# Altium schematic sheet IR_LED.SchDoc
size 420 x 297 mm; Revision: V1.2.1; SheetNumber: 9; SheetTotal: 11
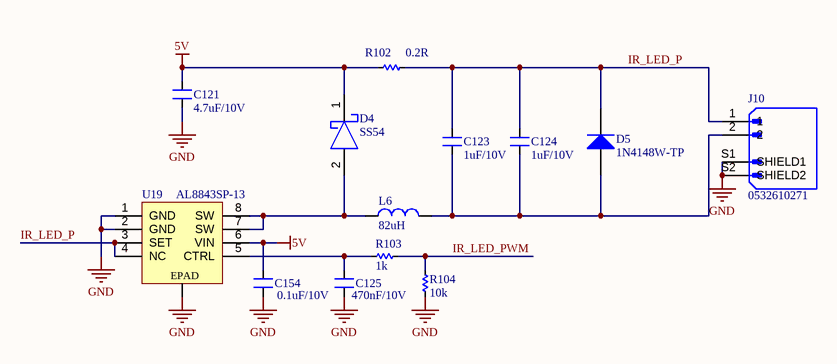
[diagram p0: IR_LED.SchDoc]

## Parts
C121  4.7uF/10V  [CAP_C_1608X80]
C123  1uF/10V  [CAP_C_1608X80]
C124  1uF/10V  [CAP_C_1608X80]
C125  470nF/10V  [CAP_C_1608X80]
C154  0.1uF/10V  [CAP_C_1608X80]
D4  SS54  [DO214-AC-SMA]
D5  1N4148W-TP  [SOD-123]
J10  0532610271  [0532610271]
L6  82uH  [L-SMD-M-4.8x4.8x2.8mm]
R102  0.2R  [RES_C_3216X70]
R103  1k  [RES_C_1608X60]
R104  10k  [RES_C_1608X60]
U19  AL8843SP-13  [SO8_EPAD]

## Nets
5V: C121.2 C154.2 D4.1 R102.2 U19.6(VIN)
GND: C121.1 C125.1 C154.1 J10.S1(SHIELD1) J10.S2(SHIELD2) R104.1 U19.1(GND) U19.2(GND) U19.EPAD
IR_LED_P: C123.2 C124.2 D5.2(K) J10.1 R102.1 U19.3(SET) U19.4(NC)
IR_LED_PWM: R103.2 R104.2
NetC123_1: C123.1 C124.1 D5.1(A) J10.2 L6.2
NetC125_2: C125.2 R103.1 U19.5(CTRL)
NetD4_2: D4.2 L6.1 U19.7(SW) U19.8(SW)

## Notes on the sheet
- Project:
- BEE-PC1
- Sub-system:
- NANORACK_EXP_CONTROLLER
- Design by:
- SANG HUYNH
- BAO BUI Q.
- Sheet title:
- Sheet
- A3
- of
- Checked by:
- Approved by:
- VU PHAM
- Revision:
- Document No:
- Size:
- Date:

## Library data of the parts
C121 C123-C125 C154 = Capacitors: Value: 33pF
D4 = SS54: DIODE SCHOTTKY 60V 3A DO214AA
D5 = 1N4148-W-7: DIODE GEN PURP 100V 300MA SOD123; MPN: 1N4148W-7-F; MFR: Diodes Incorporated; Solder: SMT; Value: 100V/300MA
J10 = CONN_SMD_02: CONN HEADER SMD R/A 2POS 1.25MM
L6 = L-SMD-1: SRR4828A-820M; partNo: 78477010; Manufacturer: Wurth Elektronik; Inductance: 1.0 μH; ComponentLink1Description: Manufacturer; ComponentLink1URL: http://www.we-online.de; Created by: Baojun Chen; Created Date: Nov.2015; ComponentLink2Description: Datasheet; ComponentLink2URL: http://katalog.we-online.de/pbs/datasheet/78477010.pdf
R102 = Res-SMD: RES 0.2 OHM 1% 1W 1206; Manufacturer: Generic Components; Class: Passive; Published: 08/06/2000; Publisher: Altium Hobart Technology Centre
R103 R104 = Res SMD: SMD; Manufacturer: Generic Components; Class: Passive; Published: 08/06/2000; Publisher: Altium Hobart Technology Centre
U19 = AL8843SP-13: IC LED DRIVER RGLTR PWM 3A 8SO